# Altium schematic sheet Sheet1.SchDoc
size 420 x 297 mm; Address1: Address1; Address2: Address2; Address3: Address3; Address4: Address4; DocumentNumber: КПБТ.468739.004 Э3; SheetNumber: 1; SheetTotal: 2; Scale: 1:1; DocumentType: Схема электрическая принципиальная; FirstReferrence: АБВГ.123456.001
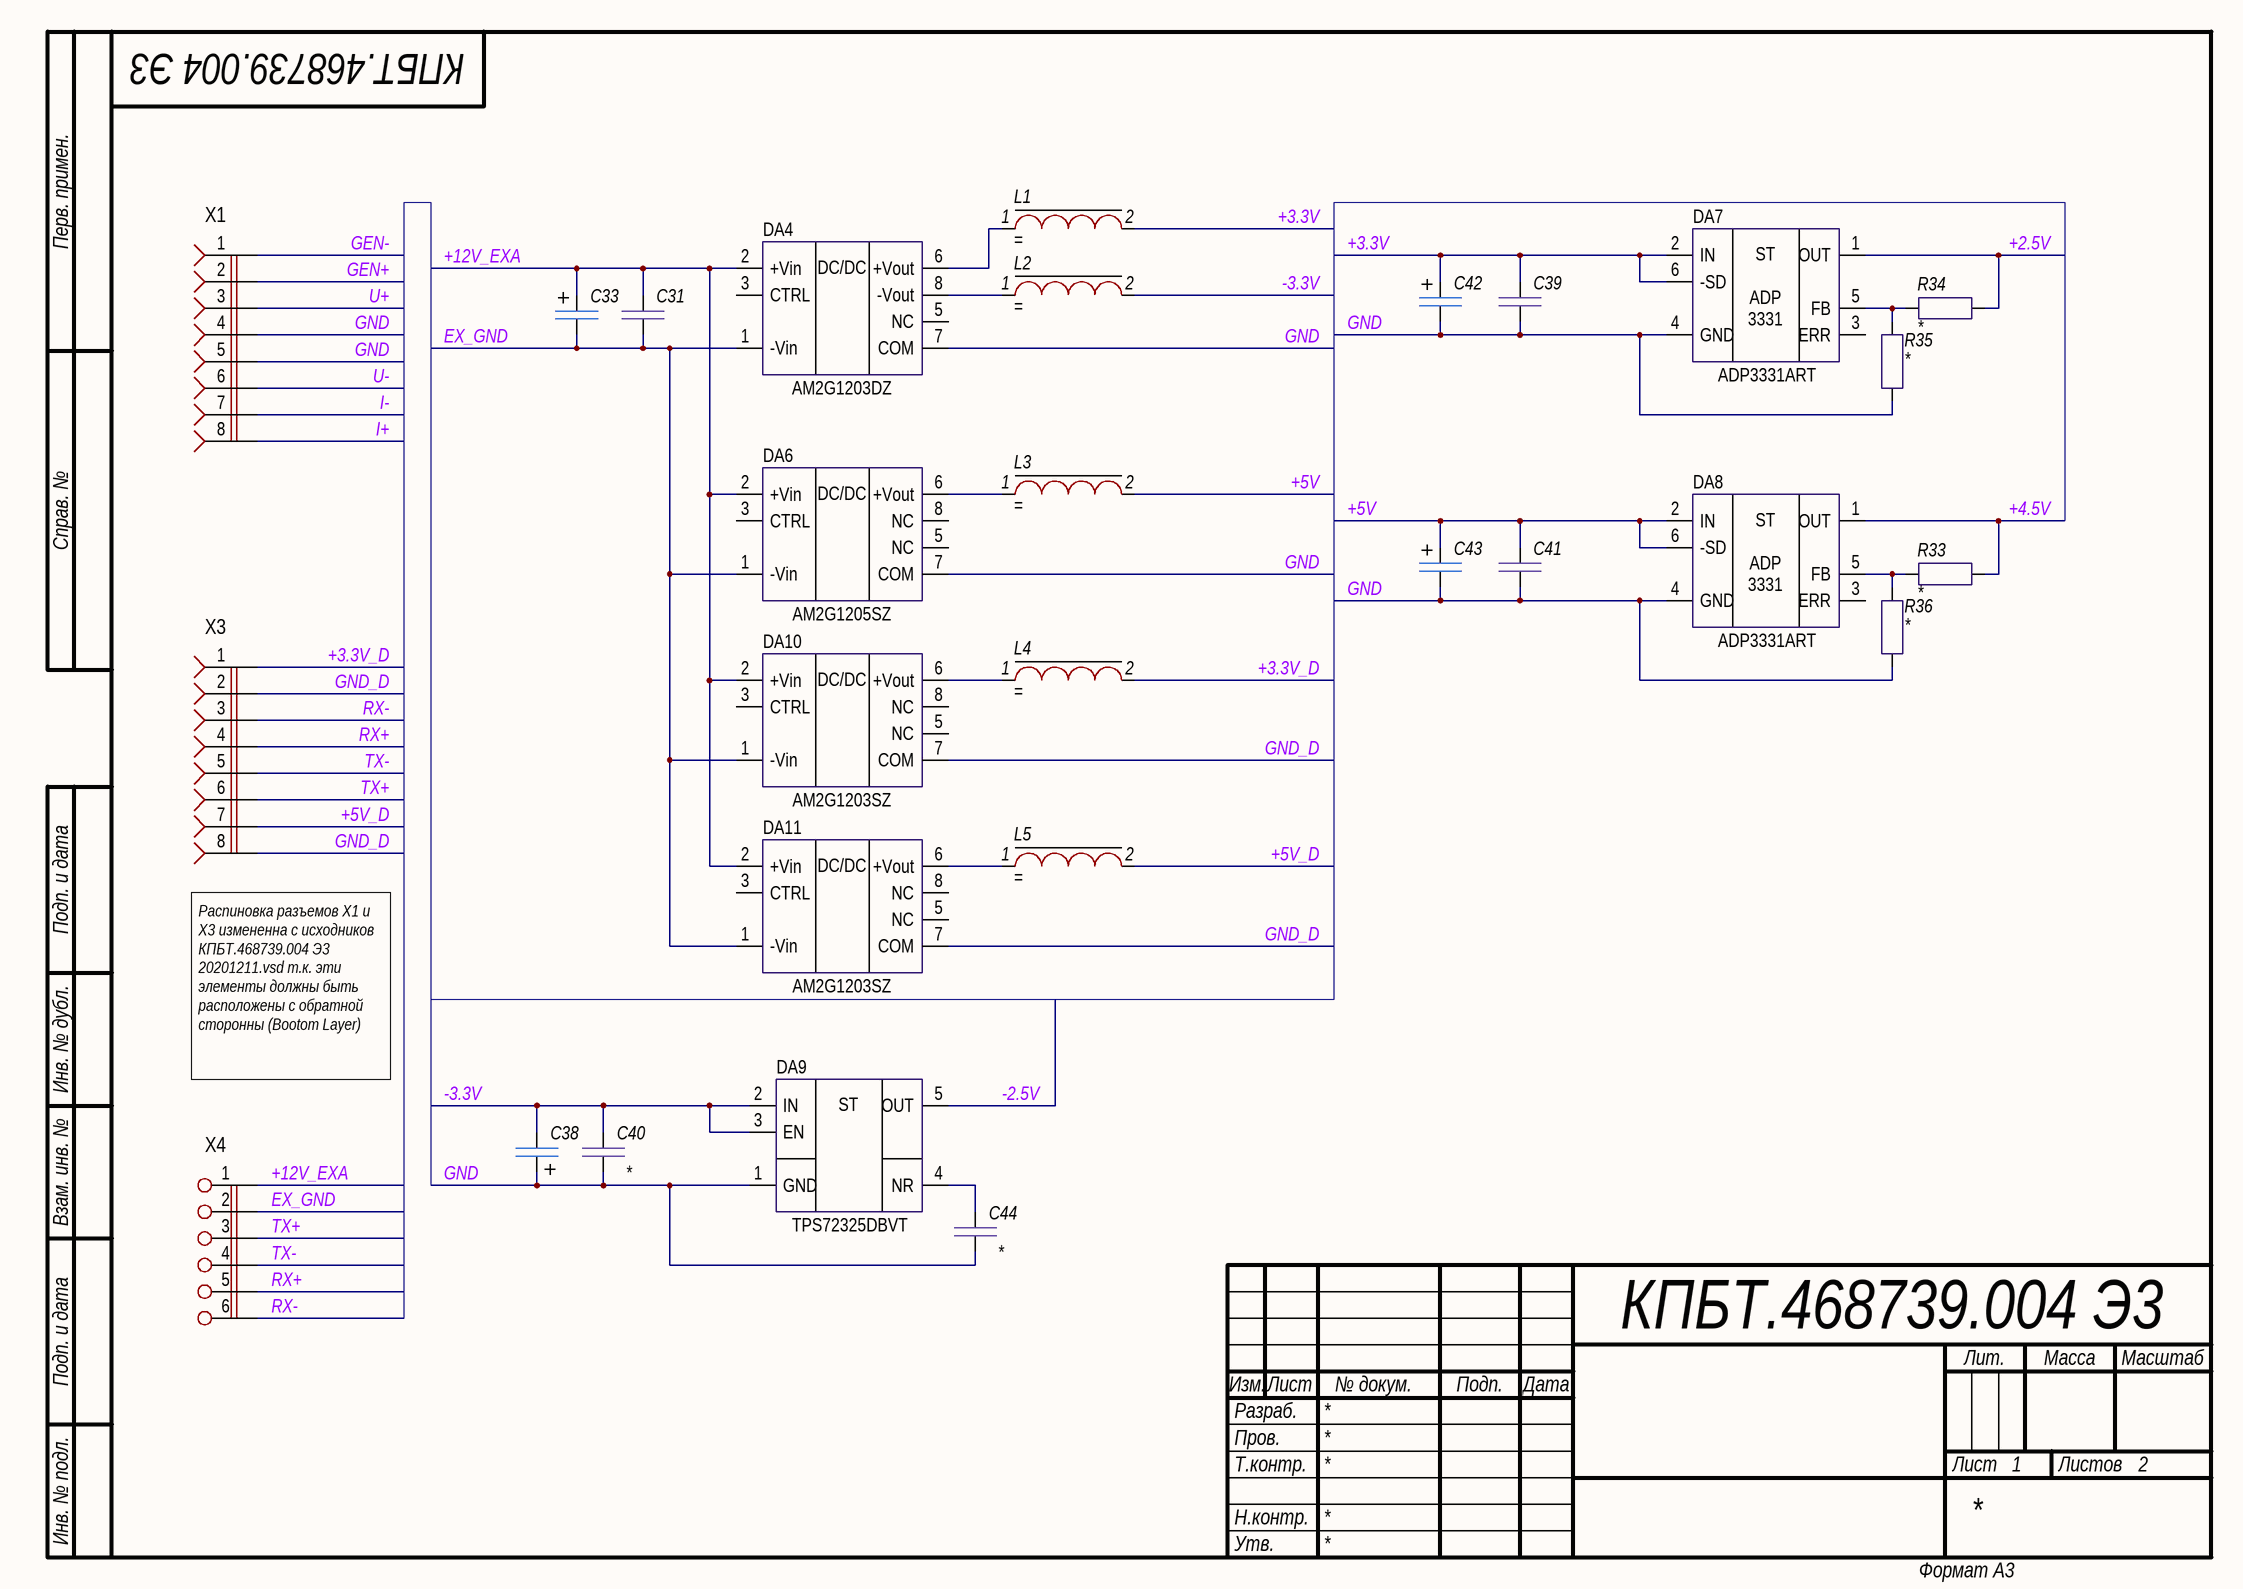
[diagram p0: Sheet1.SchDoc]

## Parts
C31  *  [CAP:0805]  (value not drawn)
C33  (no value)  [CAPT: tepy B]
C38  (no value)  [CAPT: tepy B]
C39  *  [CAP:0805]  (value not drawn)
C40  *  [CAP:0805]
C41  *  [CAP:0805]  (value not drawn)
C42  (no value)  [CAPT: tepy B]
C43  (no value)  [CAPT: tepy B]
C44  *  [CAP:0805]
DA4  AM2G1203DZ  [SIP-8]
DA6  AM2G1205SZ  [SIP-8]
DA7  ADP3331ART  [SOT23-6]
DA8  ADP3331ART  [SOT23-6]
DA9  TPS72325DBVT  [SOT23-5]
DA10  AM2G1203SZ  [SIP-8]
DA11  AM2G1203SZ  [SIP-8]
L1  (no value)  [LQH55DNxxM03]
L2  (no value)  [LQH55DNxxM03]
L3  (no value)  [LQH55DNxxM03]
L4  (no value)  [LQH55DNxxM03]
L5  (no value)  [LQH55DNxxM03]
R33  *  [RES:0805]
R34  *  [RES:0805]
R35  *  [RES:0805]
R36  *  [RES:0805]
X1  PBS-8  [PBS-8]  (value not drawn)
X3  PBS-8  [PBS-8]  (value not drawn)
X4  (no value)  [2EDGVM-5.0-06P-14-00AH]

## Nets
+2.5V: DA7.1(OUT) R34.2
+3.3V: C39.1 C42.2 DA7.2(IN) DA7.6(-SD) L1.2
+3.3V_D: L4.2 X3.1
+4.5V: DA8.1(OUT) R33.2
+5V: C41.1 C43.2 DA8.2(IN) DA8.6(-SD) L3.2
+5V_D: L5.2 X3.7
+12V_EXA: C31.1 C33.2 DA4.2(+Vin) DA6.2(+Vin) DA10.2(+Vin) DA11.2(+Vin) X4.1
-2.5V: DA9.5(OUT)
-3.3V: C38.1 C40.2 DA9.2(IN) DA9.3(EN) L2.2
EX_GND: C31.2 C33.1 DA4.1(-Vin) DA6.1(-Vin) DA10.1(-Vin) DA11.1(-Vin) X4.2
GEN+: X1.2
GEN-: X1.1
GND: C38.2 C39.2 C40.1 C41.2 C42.1 C43.1 C44.2 DA4.7(COM) DA6.7(COM) DA7.4(GND) DA8.4(GND) DA9.1(GND) R35.2 R36.2 X1.4 X1.5
GND_D: DA10.7(COM) DA11.7(COM) X3.2 X3.8
I+: X1.8
I-: X1.7
RX+: X3.4 X4.5
RX-: X3.3 X4.6
TX+: X3.6 X4.3
TX-: X3.5 X4.4
U+: X1.3
U-: X1.6
NetC44_1: C44.1 DA9.4(NR)
NetDA4_6: DA4.6(+Vout) L1.1
NetDA4_8: DA4.8(-Vout) L2.1
NetDA6_6: DA6.6(+Vout) L3.1
NetDA7_5: DA7.5(FB) R34.1 R35.1
NetDA8_5: DA8.5(FB) R33.1 R36.1
NetDA10_6: DA10.6(+Vout) L4.1
NetDA11_6: DA11.6(+Vout) L5.1

Not connected (* = marked no-connect by the designer): DA4 3(CTRL) 5(NC); DA6 3(CTRL) 5(NC) 8(NC); DA7 3(ERR); DA8 3(ERR); DA10 3(CTRL) 5(NC) 8(NC); DA11 3(CTRL) 5(NC) 8(NC)

## Notes on the sheet
- (near X3) Распиновка разъемов Х1 и Х3 измененна с исходников КПБТ.468739.004 Э3 20201211.vsd т.к. эти элементы должны быть расположены с обратной сторонны (Bootom Layer)
- Перв. примен.
- Справ. №
- Подп. и дата
- Инв. № дубл.
- Взам. инв. №
- Разраб.
- Изм.
- Лист
- № докум.
- Подп.
- Дата
- Лит.
- Масса
- Масштаб
- Пров.
- Т.контр.
- Листов
- Инв. № подл.
- Н.контр.
- Утв.
- Формат А3
- (in symbol ADP3331ART) ST / ADP / 3331
- (in symbol AM2G1203DZ) DC/DC
- (in symbol AM2G1203SZ) DC/DC
- (in symbol AM2G1205SZ) DC/DC
- (in symbol TPS72325DBVT) ST /

## Library data of the parts
C31 C39-C41 C44 = Capacitor 0805: Case: *; HelpURL: *; Manufacature: *; Model: *; Value: *; Part Number: Capacitor 0805
C33 C38 C42 C43 = CAPT: tepy B: Part Number: CAPT: tepy B
L1-L5 = LQH55DN101M03: Model: *; Manufcacture: *; HelpURL: *; Case: *; Value: *; Part Number: LQH55DN101M03
R33-R36 = Resistor 0805: Total Power Dissipation: 0,125W; Model: *; Manufcacture: *; HelpURL: *; Case: *; Value: *; Part Number: Resistor 0805
X4 = 2EDGxx-5.0-06P-14-00AH: Model: *; Manufcacture: *; HelpURL: *; Case: *; Value: *; Part Number: 2EDGxx-5.0-06P-14-00AH
DA4 = AM2G1203DZ: Model: *; Manufcacture: *; HelpURL: *; Case: *; Value: *; Part Number: AM2G1203DZ
DA6 = AM2G1205SZ: Model: *; Manufcacture: *; HelpURL: *; Case: *; Value: *; Part Number: AM2G1205SZ
DA7 DA8 = ADP3331ART: Model: *; Manufcacture: *; HelpURL: *; Case: *; Value: *; Part Number: ADP3331ART
DA9 = TPS72325DBVT: Model: *; Manufcacture: *; HelpURL: *; Case: *; Value: *; Part Number: TPS72325DBVT
DA10 DA11 = AM2G1203SZ: Model: *; Manufcacture: *; HelpURL: *; Case: *; Value: *; Part Number: AM2G1203SZ
X1 X3 = PBS-8: Value: *; Part Number: PBS-8